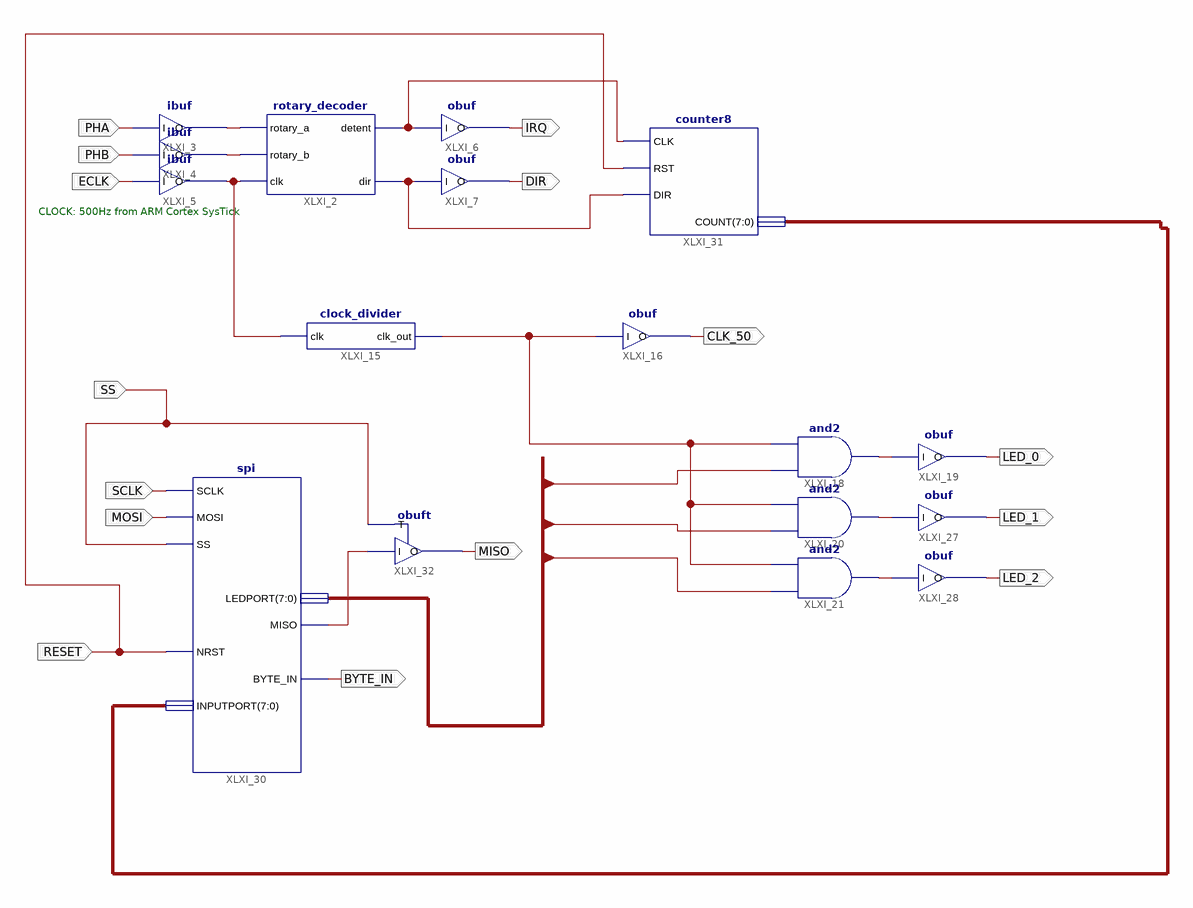
[diagram p0: schematic sheet 1]
// Xilinx ISE schematic FrontPanel.sch (xc9500xl) as structural Verilog: 17 symbols, 15 ports
module FrontPanel (
  input  PHA,
  input  PHB,
  input  ECLK,
  input  MOSI,
  input  SCLK,
  input  RESET,
  input  SS,
  output IRQ,
  output DIR,
  output CLK_50,
  output LED_0,
  output LED_1,
  output LED_2,
  output BYTE_IN,
  output MISO
);

  wire XLXN_1, XLXN_2, XLXN_15, XLXN_24, XLXN_27, XLXN_28, XLXN_41, XLXN_81, XLXN_83, XLXN_85;
  wire [7:0] LED, XLXN_78;

  rotary_decoder XLXI_2 (.rotary_a(XLXN_1), .rotary_b(XLXN_2), .clk(XLXN_15), .detent(XLXN_81), .dir(XLXN_83));
  ibuf XLXI_3 (.I(PHA), .O(XLXN_1));
  ibuf XLXI_4 (.I(PHB), .O(XLXN_2));
  ibuf XLXI_5 (.I(ECLK), .O(XLXN_15));
  obuf XLXI_7 (.I(XLXN_83), .O(DIR));
  clock_divider #(.PWR_MODE("LOW")) XLXI_15 (.clk(XLXN_15), .clk_out(XLXN_41));
  obuf XLXI_16 (.I(XLXN_41), .O(CLK_50));
  and XLXI_18 (XLXN_24, LED[0], XLXN_41);
  obuf XLXI_19 (.I(XLXN_24), .O(LED_0));
  and XLXI_20 (XLXN_27, LED[1], XLXN_41);
  and XLXI_21 (XLXN_28, LED[2], XLXN_41);
  obuf XLXI_27 (.I(XLXN_27), .O(LED_1));
  obuf XLXI_28 (.I(XLXN_28), .O(LED_2));
  obuf XLXI_6 (.I(XLXN_81), .O(IRQ));
  spi #(.PWR_MODE("LOW")) XLXI_30 (
    .SCLK(SCLK), .MOSI(MOSI), .SS(SS), .NRST(RESET), .MISO(XLXN_85), .BYTE_IN(BYTE_IN), .LEDPORT(LED),
    .INPUTPORT(XLXN_78));
  counter8 #(.PWR_MODE("LOW")) XLXI_31 (.CLK(XLXN_81), .RST(RESET), .DIR(XLXN_83), .COUNT(XLXN_78));
  obuft XLXI_32 (.I(XLXN_85), .T(SS), .O(MISO));

  // Notes on the sheet:
  //   CLOCK: 500Hz from ARM Cortex SysTick
endmodule
